# Altium schematic sheet STM32.SchDoc
size 508 x 281 mm
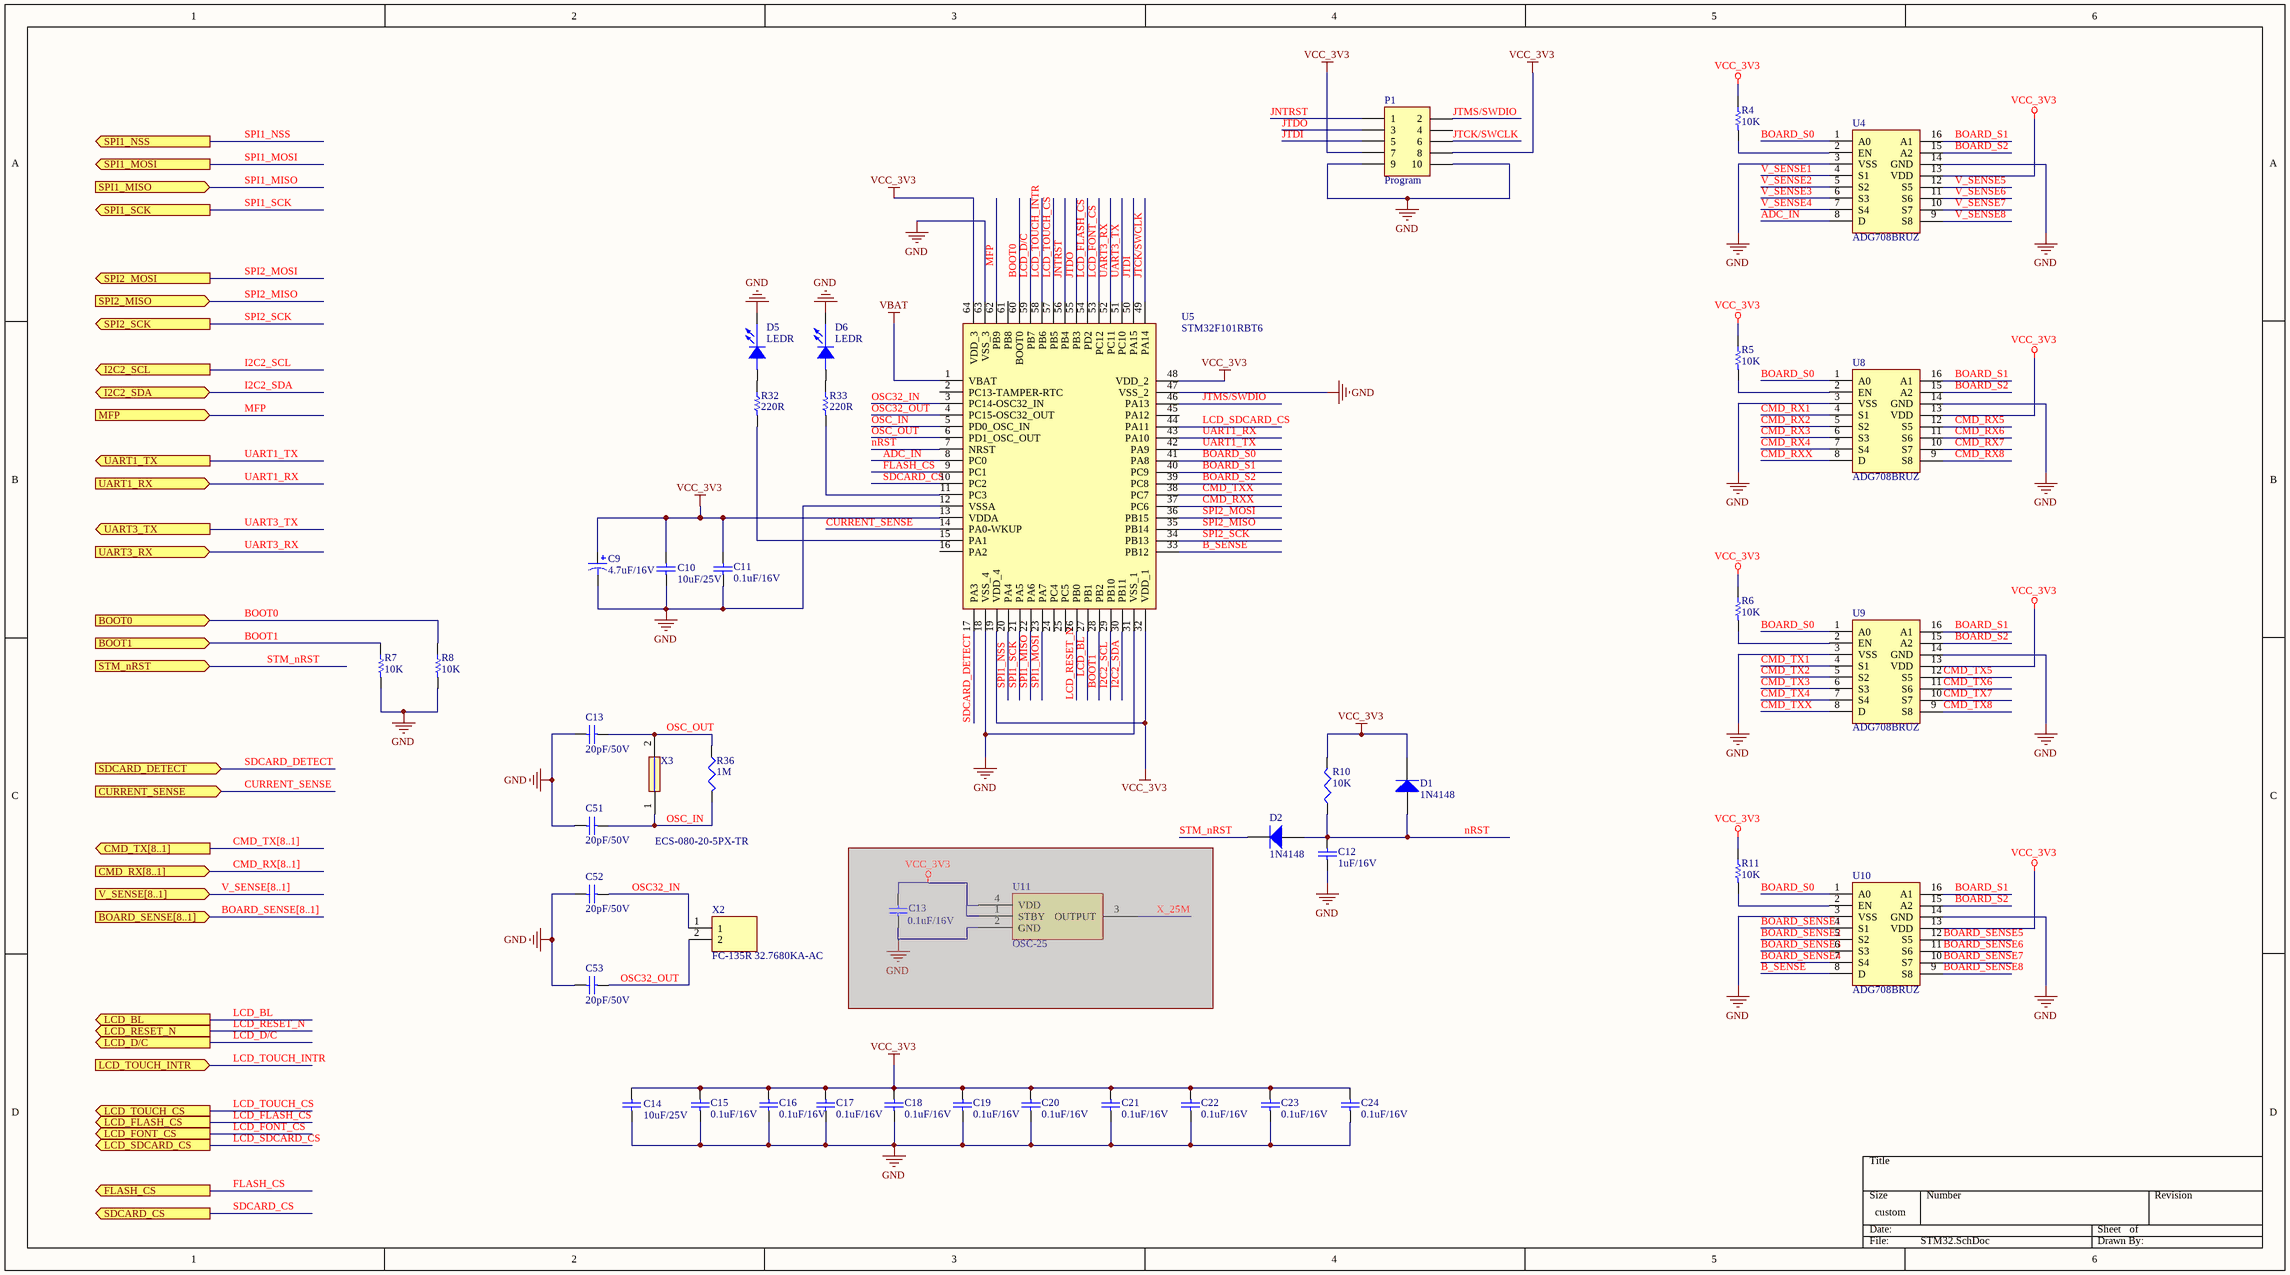
[diagram p0: STM32.SchDoc]

## Parts
(Parts that share a designator on the sheet are numbered #1, #2 ... from top to bottom, then left to right.)
C9  4.7uF/16V  [CASE-A]
C10  10uF/25V  [0805C]
C11  0.1uF/16V  [0603C]
C12  1uF/16V  [0603C]
C13#1  20pF/50V  [0603C]
C13#2  0.1uF/16V  [0603C]  (masked out: inside a compile mask, not in the netlist)
C14  10uF/25V  [0805C]
C15  0.1uF/16V  [0603C]
C16  0.1uF/16V  [0603C]
C17  0.1uF/16V  [0603C]
C18  0.1uF/16V  [0603C]
C19  0.1uF/16V  [0603C]
C20  0.1uF/16V  [0603C]
C21  0.1uF/16V  [0603C]
C22  0.1uF/16V  [0603C]
C23  0.1uF/16V  [0603C]
C24  0.1uF/16V  [0603C]
C51  20pF/50V  [0603C]
C52  20pF/50V  [0603C]
C53  20pF/50V  [0603C]
D1  1N4148  [1N4148W-13-F]
D2  1N4148  [1N4148W-13-F]
D5  LEDR  [LED_0603]
D6  LEDR  [LED_0603]
P1  Program  [HDR2X5]
R4  10K  [0603R]
R5  10K  [0603R]
R6  10K  [0603R]
R7  10K  [0603R]
R8  10K  [0603R]
R10  10K  [0603R]
R11  10K  [0603R]
R32  220R  [0603R]
R33  220R  [0603R]
R36  1M  [0805R]
U4  ADG708BRUZ  [ADG708BRUZ]
U5  STM32F101RBT6  [STM32F101RBT6]
U8  ADG708BRUZ  [ADG708BRUZ]
U9  ADG708BRUZ  [ADG708BRUZ]
U10  ADG708BRUZ  [ADG708BRUZ]
U11  OSC-25  [ASE-25.000MHZ-LC-T]  (masked out: inside a compile mask, not in the netlist)
X2  FC-135R 32.7680KA-AC  [FC-135R 32.7680KA-AC]
X3  ECS-080-20-5PX-TR  [ECS-080-20-5PX-TR]

## Ports
BOARD_SENSE[8..1] (in), BOOT0 (in), BOOT1 (in), CMD_RX[8..1] (in), CMD_TX[8..1] (out), CURRENT_SENSE (in), FLASH_CS (out), I2C2_SCL (out), I2C2_SDA (bidir), LCD_BL (out), LCD_D/C (out), LCD_FLASH_CS (out), LCD_FONT_CS (out), LCD_RESET_N (out), LCD_SDCARD_CS (out), LCD_TOUCH_CS (out), LCD_TOUCH_INTR (in), MFP (in), SDCARD_CS (out), SDCARD_DETECT (in), SPI1_MISO (in), SPI1_MOSI (out), SPI1_NSS (out), SPI1_SCK (out), SPI2_MISO (in), SPI2_MOSI (out), SPI2_SCK (out), STM_nRST (in), UART1_RX (in), UART1_TX (out), UART3_RX (in), UART3_TX (out), V_SENSE[8..1] (in)

## Nets
GND: C9.2 C10.1 C11.2 C12.2 C13#1.2 C14.1 C15.2 C16.2 C17.2 C18.2 C19.2 C20.2 C21.2 C22.2 C23.2 C24.2 C51.2 C52.2 C53.2 D5.2(CATHODE) D6.2(CATHODE) P1.9 P1.10 R7.2 R8.2 U4.3(VSS) U4.14(GND) U5.12(VSSA) U5.18(VSS_4) U5.31(VSS_1) U5.47(VSS_2) U5.63(VSS_3) U8.3(VSS) U8.14(GND) U9.3(VSS) U9.14(GND) U10.3(VSS) U10.14(GND)
VBAT: U5.1(VBAT)
VCC_3V3: C9.1 C10.2 C11.1 C14.2 C15.1 C16.1 C17.1 C18.1 C19.1 C20.1 C21.1 C22.1 C23.1 C24.1 D1.2(K) P1.7 P1.8 R4.1 R5.1 R6.1 R10.2 R11.1 U4.13(VDD) U5.13(VDDA) U5.19(VDD_4) U5.32(VDD_1) U5.48(VDD_2) U5.64(VDD_3) U8.13(VDD) U9.13(VDD) U10.13(VDD)
ADC_IN: U4.8(D) U5.8(PC0)
B_SENSE: U5.33(PB12) U10.8(D)
BOARD_S0: U4.1(A0) U5.41(PA8) U8.1(A0) U9.1(A0) U10.1(A0)
BOARD_S1: U4.16(A1) U5.40(PC9) U8.16(A1) U9.16(A1) U10.16(A1)
BOARD_S2: U4.15(A2) U5.39(PC8) U8.15(A2) U9.15(A2) U10.15(A2)
BOARD_SENSE1: U10.4(S1)
BOARD_SENSE2: U10.5(S2)
BOARD_SENSE3: U10.6(S3)
BOARD_SENSE4: U10.7(S4)
BOARD_SENSE5: U10.12(S5)
BOARD_SENSE6: U10.11(S6)
BOARD_SENSE7: U10.10(S7)
BOARD_SENSE8: U10.9(S8)
BOOT0: R8.1 U5.60(BOOT0) ; port BOOT0
BOOT1: R7.1 U5.28(PB2) ; port BOOT1
CMD_RX1: U8.4(S1)
CMD_RX2: U8.5(S2)
CMD_RX3: U8.6(S3)
CMD_RX4: U8.7(S4)
CMD_RX5: U8.12(S5)
CMD_RX6: U8.11(S6)
CMD_RX7: U8.10(S7)
CMD_RX8: U8.9(S8)
CMD_RXX: U5.37(PC6) U8.8(D)
CMD_TX1: U9.4(S1)
CMD_TX2: U9.5(S2)
CMD_TX3: U9.6(S3)
CMD_TX4: U9.7(S4)
CMD_TX5: U9.12(S5)
CMD_TX6: U9.11(S6)
CMD_TX7: U9.10(S7)
CMD_TX8: U9.9(S8)
CMD_TXX: U5.38(PC7) U9.8(D)
CURRENT_SENSE: U5.14(PA0-WKUP) ; port CURRENT_SENSE
FLASH_CS: U5.9(PC1) ; port FLASH_CS
I2C2_SCL: U5.29(PB10) ; port I2C2_SCL
I2C2_SDA: U5.30(PB11) ; port I2C2_SDA
JNTRST: P1.1 U5.56(PB4)
JTCK/SWCLK: P1.6 U5.49(PA14)
JTDI: P1.5 U5.50(PA15)
JTDO: P1.3 U5.55(PB3)
JTMS/SWDIO: P1.2 U5.46(PA13)
LCD_BL: U5.27(PB1) ; port LCD_BL
LCD_D/C: U5.59(PB7) ; port LCD_D/C
LCD_FLASH_CS: U5.54(PD2) ; port LCD_FLASH_CS
LCD_FONT_CS: U5.53(PC12) ; port LCD_FONT_CS
LCD_RESET_N: U5.26(PB0) ; port LCD_RESET_N
LCD_SDCARD_CS: U5.44(PA11) ; port LCD_SDCARD_CS
LCD_TOUCH_CS: U5.57(PB5) ; port LCD_TOUCH_CS
LCD_TOUCH_INTR: U5.58(PB6) ; port LCD_TOUCH_INTR
MFP: U5.62(PB9) ; port MFP
nRST: C12.1 D1.1(A) D2.1(A) R10.1 U5.7(NRST)
OSC32_IN: C52.1 U5.3(PC14-OSC32_IN) X2.1
OSC32_OUT: C53.1 U5.4(PC15-OSC32_OUT) X2.2
OSC_IN: C51.1 R36.1 U5.5(PD0_OSC_IN) X3.1
OSC_OUT: C13#1.1 R36.2 U5.6(PD1_OSC_OUT) X3.2
SDCARD_CS: U5.10(PC2) ; port SDCARD_CS
SDCARD_DETECT: U5.17(PA3) ; port SDCARD_DETECT
SPI1_MISO: U5.22(PA6) ; port SPI1_MISO
SPI1_MOSI: U5.23(PA7) ; port SPI1_MOSI
SPI1_NSS: U5.20(PA4) ; port SPI1_NSS
SPI1_SCK: U5.21(PA5) ; port SPI1_SCK
SPI2_MISO: U5.35(PB14) ; port SPI2_MISO
SPI2_MOSI: U5.36(PB15) ; port SPI2_MOSI
SPI2_SCK: U5.34(PB13) ; port SPI2_SCK
STM_nRST: D2.2(K) ; port STM_nRST
UART1_RX: U5.43(PA10) ; port UART1_RX
UART1_TX: U5.42(PA9) ; port UART1_TX
UART3_RX: U5.52(PC11) ; port UART3_RX
UART3_TX: U5.51(PC10) ; port UART3_TX
V_SENSE1: U4.4(S1)
V_SENSE2: U4.5(S2)
V_SENSE3: U4.6(S3)
V_SENSE4: U4.7(S4)
V_SENSE5: U4.12(S5)
V_SENSE6: U4.11(S6)
V_SENSE7: U4.10(S7)
V_SENSE8: U4.9(S8)
NetD5_1: D5.1(ANODE) R32.1
NetD6_1: D6.1(ANODE) R33.1
NetR4_2: R4.2 U4.2(EN)
NetR5_2: R5.2 U8.2(EN)
NetR6_2: R6.2 U9.2(EN)
NetR11_2: R11.2 U10.2(EN)
NetR32_2: R32.2 U5.15(PA1)
NetR33_2: R33.2 U5.11(PC3)

Not connected (* = marked no-connect by the designer): P1 4; U5 2(PC13-TAMPER-RTC) 16(PA2) 24(PC4) 25(PC5) 45(PA12) 61(PB8)

## Buses and harness runs
bus BOARD_SENSE[8..1] = port BOARD_SENSE[8..1]
bus CMD_RX[8..1] = port CMD_RX[8..1]
bus CMD_TX[8..1] = port CMD_TX[8..1]
bus V_SENSE[8..1] = port V_SENSE[8..1]

## Library data of the parts
C9 = Cap Pol1: Tantalum Capacitors - Solid SMD 16V 4.7uF 1206; Mfr: KEMET; Mfr Part No: T495A475K016ATA2K0; Value: 4.7uF/16V; Package: 1206; Price: 1.83; Stockiest: MOUSER; Stockiest Part No: 80-T495A475K16ATA2K0
C10 C14 = Cap: Multilayer Ceramic Capacitors MLCC - SMD/SMT 0805 25VDC 10uF 20% X5R; Mfr: Taiyo Yuden; Mfr Part No: TMK212BBJ106MG-T; Package: 0805; Price: 0.232; Stockiest: MOUSER; Stockiest Part No: 963-TMK212BBJ106MG-T; Value: 10uF/25V
C11 C15-C24 = Cap: Multilayer Ceramic Capacitors MLCC - SMD/SMT 0603 16VDC 0.1uF 10% X7R AEC-Q2000; Mfr: Taiyo Yuden; Mfr Part No: EMK107B7104KAHT; Value: 0.1uF/16V; Package: 0603; Price: 0.101; Stockiest: MOUSER; Stockiest Part No: 963-EMK107B7104KAHT
C12 = Cap: Multilayer Ceramic Capacitors MLCC - SMD/SMT 16volts 1uF X7R 10%; Mfr: KEMET; Mfr Part No: C0603C105K4RAC7411; Value: 1uF/16V; Package: 0603; Price: 0.101; Stockiest: MOUSER; Stockiest Part No: 80-C0603C105K4RLR
C13#1 C51-C53 = Cap: Multilayer Ceramic Capacitors MLCC - SMD/SMT 50V 20pF 0603 C0G 5% AEC-Q200; Mfr Part No: C0603C200J5GACAUTO; Mfr: KEMET; Value: 20pF/50V; Stockiest: MOUSER; Stockiest Part No: 80-C0603C200J5GAUTO; Package: 0603; Price: 0.322
C13#2 = Cap: Multilayer Ceramic Capacitors MLCC - SMD/SMT 0603 16VDC 0.1uF 10% X7R AEC-Q2000; Mfr Part No: EMK107B7104KAHT; Mfr: Taiyo Yuden; Value: 0.1uF/16V; Stockiest: MOUSER; Stockiest Part No: 963-EMK107B7104KAHT; Package: 0603; Price: 0.101
D1 D2 = Diode: Diodes - General Purpose, Power, Switching 400mW 100Vrrm 4ns; Mfr: Diodes Incorporated; Value: 100V; Stockiest: MOUSER; Stockiest Part No: 621-1N4148W-13-F; Mfr Part No: 1N4148W-13-F; Package: SOD-123-2; Price: 0.171
D5 D6 = LED: Standard LEDs - SMD Red 631nm 14mcd 5mA; Mfr: Lite On; Mfr Part No: LTST-C193KRKT-5A; Package: 0603; Price: 0.28; Stockiest: MOUSER; Stockiest Part No: 859-LTSTC193KRKT5A; Value: RED
P1 = Header 5X2: Header, 5-Pin, Dual row; LatestRevisionDate: 17-Jul-2002; LatestRevisionNote: Re-released for DXP Platform.; Publisher: Altium Limited
R4-R8 R11 = Res1: Thick Film Resistors - SMD 0603 10Kohms 1% Anti-Sulfur AEC-Q200; Mfr: ROHM Semiconductor; Mfr Part No: SFR03EZPF1002; Value: 10K; Package: 0603; Price: 0.101; Stockiest: MOUSER; Stockiest Part No: 755-SFR03EZPF1002
R10 = 0402_RES: Thick Film Resistors - SMD 0603 10Kohms 1% Anti-Sulfur AEC-Q200; Mfr Part No: SFR03EZPF1002; Mfr: ROHM Semiconductor; Package: 0603; Price: 0.101; Stockiest Part No: 755-SFR03EZPF1002; Value: 10K; Stockiest: MOUSER
R32 R33 = Res1: Thick Film Resistors - SMD 1/10Watt 220ohms 5% Commercial Use; Mfr: Vishay / Dale; Mfr Part No: CRCW0603220RJNEAC; Package: 0603; Price: 0.101; Stockiest: MOUSER; Stockiest Part No: 71-CRCW0603220RJNEAC; Value: 220R
R36 = 0805_RES: Thick Film Resistors - SMD 0603 0.25W 1% 1Mohm AEC-Q200; Mfr Part No: ERJ-UP3F1004V; Mfr: Panasonic; Price: 0.262; Stockiest: MOUSER; Stockiest Part No: 667-ERJ-UP3F1004V; Value: 1M; Package: 0603
U4 U8-U10 = ADG708BRUZ: Multiplexer Switch ICs 8-CHANNEL MUX; Mfr: Analog Devices; Mfr Part No: ADG708BRUZ; Price: 3.68; Stockiest: MOUSER; Stockiest Part No: 584-ADG708BRUZ
U5 = STM32F101RBT6: ARM Microcontrollers - MCU 32BIT Cortex M3 128K 16KB RAM 1X12 ADC; Mfr: STMicroelectronics; Mfr Part No: STM32F101RBT6; Price: 5.12; Stockiest: MOUSER; Stockiest Part No: 511-STM32F101RBT6
U11 = CRYSTAL: Standard Clock Oscillators 25.0 MHZ 3.3V 50PPM SMD 32; Mfr: ABRACON; Value: 25MHZ; Mfr Part No: ASE-25.000MHZ-LC-T; Price: 1.42; Stockiest: MOUSER; Stockiest Part No: 815-ASE25.000MHZLCT
X2 = FC-135R_32.7680KA-A0: Crystals SMD XTL KHZ +/-20PPM,-40 85C 9.0PF BULK; Mfr: Epson Timing; Value: 32.768K; Mfr Part No: FC-135R 32.7680KA-AC; Price: 0.584; Stockiest: MOUSER; Stockiest Part No: 732-5R32.7680KA-AC
X3 = ABLS-12.000MHZ-B4-T: Crystals 8MHz 20pF -10C +70C; Mfr: ECS; Mfr Part No: ECS-080-20-5PX-TR; Price: 0.273; Stockiest: MOUSER; Stockiest Part No: 520-ECS-080-20-5PX-T; Value: 8Mhz